# EAGLE design USBHostShield-v13 (EAGLE 5.00)
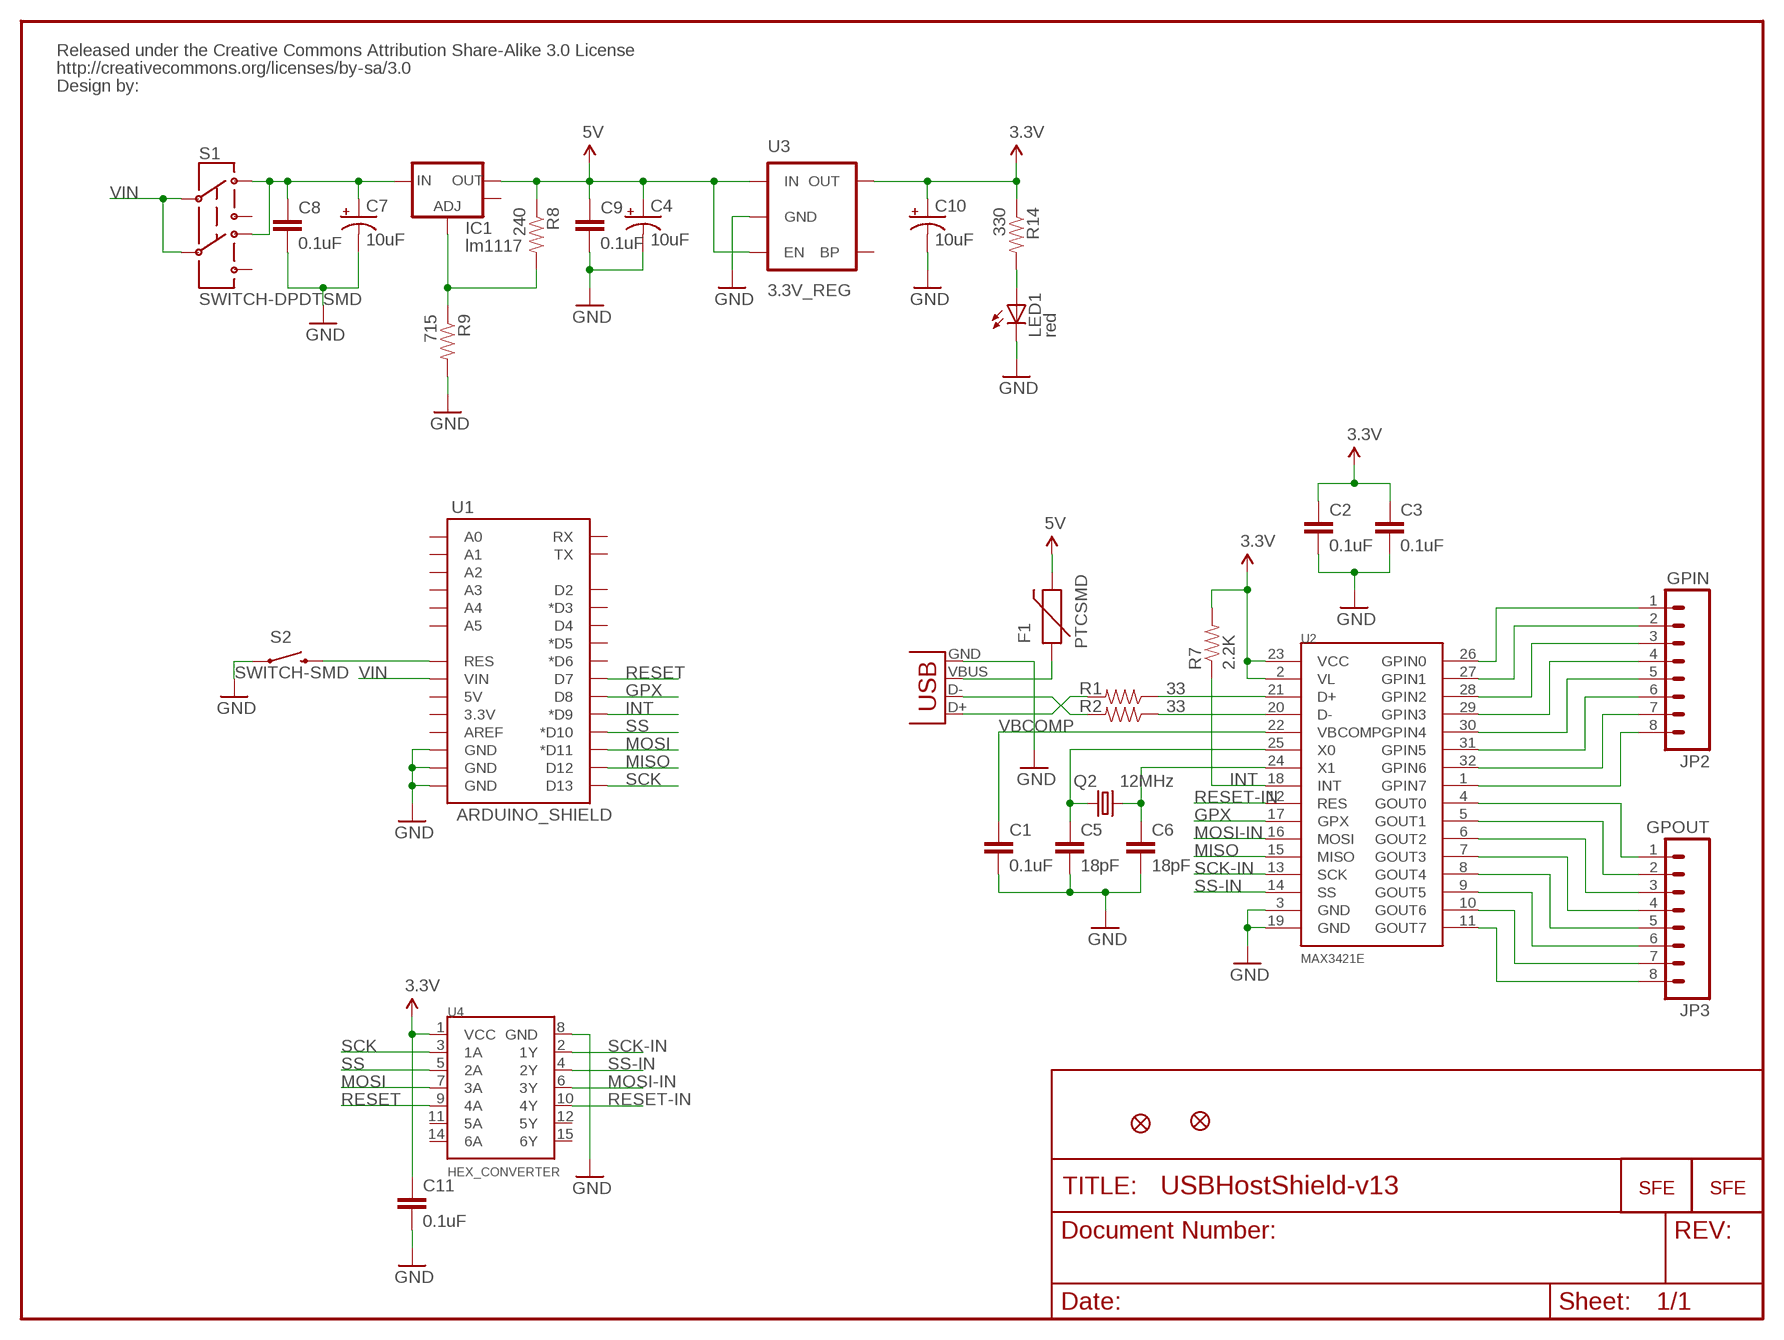
[diagram p0: schematic, sheet 1]

## Parts
C1  0.1uF  CAP0402-CAP  [0402-CAP]
C2  0.1uF  CAP0402-CAP  [0402-CAP]
C3  0.1uF  CAP0402-CAP  [0402-CAP]
C4  10uF  CAP_POL1206  [EIA3216]
C5  18pF  CAP0402-CAP  [0402-CAP]
C6  18pF  CAP0402-CAP  [0402-CAP]
C7  10uF  CAP_POL1206  [EIA3216]
C8  0.1uF  CAP0402-CAP  [0402-CAP]
C9  0.1uF  CAP0402-CAP  [0402-CAP]
C10  10uF  CAP_POL1206  [EIA3216]
C11  0.1uF  CAP0402-CAP  [0402-CAP]
F1  PTCSMD  [PTC-1206]
IC1  lm1117  V_REG_LM1117SOT223  [SOT223]
JP2  GPIN  M08  [1X08]
JP3  GPOUT  M08  [1X08]
JP4  LOGO-SFESK  [SFE-LOGO-FLAME]
JP5  LOGO-SFENEW  [SFE-NEW-WEBLOGO]
JP6  FIDUCIAL1X2  [FIDUCIAL-1X2]
JP7  FIDUCIAL1X2  [FIDUCIAL-1X2]
LED1  red  LED0603  [LED-0603]
Q2  12MHz  CRYSTAL5X3  [CRYSTAL-SMD-5X3]
R1  33  RESISTOR0402-RES  [0402-RES]
R2  33  RESISTOR0402-RES  [0402-RES]
R7  2.2K  RESISTOR0402-RES  [0402-RES]
R8  240  RESISTOR0402-RES  [0402-RES]
R9  715  RESISTOR0402-RES  [0402-RES]
R14  330  RESISTOR0402-RES  [0402-RES]
S1  SWITCH-DPDTSMD  [AYZ0202]
S2  SWITCH-SMD  SWITCH-MOMENTARY-2SMD  [TACTILE_SWITCH_SMD]
U1  ARDUINO_SHIELD  ARDUINO_SHIELDLABEL  [DUEMILANOVE_SHIELD]
U2  MAX3421E  MAX3421ESMD  [TQFP32-5MM]
U3  3.3V_REG  V_REG_LDOSMD  [SOT23-5]
U4  HEX_CONVERTER  [SO016]
U$3  CREATIVE_COMMONS  [CREATIVE_COMMONS]
X2  USB_  [USB-A-S-SILK-FEMALE]

## Nets
3.3V: C2.1 C3.1 C10.A(+) C11.1 R7.2 R14.1 U2.2(VL) U2.23(VCC) U3.5(OUT) U4.1(VCC)
5V: C4.A(+) C9.1 F1.2 IC1.2(OUT) R8.1 U3.1(IN) U3.3(EN)
GND: C1.2 C2.2 C3.2 C4.C(-) C5.2 C6.2 C7.C(-) C8.2 C9.2 C10.C(-) C11.2 LED1.C R9.2 S2.1 U1.GND@0(GND) U1.GND@1(GND) U1.GND@2(GND) U2.3(GND) U2.19(GND) U3.2(GND) U4.8(GND) X2.GND
GPX: U1.D8 U2.17(GPX)
INT: R7.1 U1.D9(*D9) U2.18(INT)
MISO: U1.D12 U2.15(MISO)
MOSI: U1.D11(*D11) U4.7(3A)
MOSI-IN: U2.16(MOSI) U4.6(3Y)
N$1: JP2.8 U2.1(GPIN7)
N$2: R2.1 U2.20(D-)
N$3: R1.1 U2.21(D+)
N$4: JP3.1 U2.4(GOUT0)
N$5: R1.2 X2.D+
N$6: JP3.2 U2.5(GOUT1)
N$7: JP3.3 U2.6(GOUT2)
N$8: R2.2 X2.D-
N$9: C5.1 Q2.1 U2.25(X0)
N$10: C6.1 Q2.3 U2.24(X1)
N$11: IC1.1(ADJ) R8.2 R9.1
N$12: S2.3 U1.RES
N$13: JP3.4 U2.7(GOUT3)
N$14: JP3.5 U2.8(GOUT4)
N$15: JP3.6 U2.9(GOUT5)
N$16: JP3.7 U2.10(GOUT6)
N$17: JP3.8 U2.11(GOUT7)
N$18: JP2.7 U2.32(GPIN6)
N$19: JP2.6 U2.31(GPIN5)
N$20: JP2.5 U2.30(GPIN4)
N$21: JP2.4 U2.29(GPIN3)
N$22: JP2.3 U2.28(GPIN2)
N$23: JP2.2 U2.27(GPIN1)
N$24: JP2.1 U2.26(GPIN0)
N$25: LED1.A R14.2
N$138: F1.1 X2.VBUS
RESET: U1.D7 U4.9(4A)
RESET-IN: U2.12(RES) U4.10(4Y)
SCK: U1.D13 U4.3(1A)
SCK-IN: U2.13(SCK) U4.2(1Y)
SS: U1.D10(*D10) U4.5(2A)
SS-IN: U2.14(SS) U4.4(2Y)
VBCOMP: C1.1 U2.22(VBCOMP)
VBUS: C7.A(+) C8.1 IC1.3(IN) S1.1 S1.4
VIN: S1.2 S1.5 U1.VIN
Unconnected: IC1.4(OUT) S1.3 S1.6 U1.3.3V U1.5V U1.A0 U1.A1 U1.A2 U1.A3 U1.A4 U1.A5 U1.AREF U1.D2 U1.D3(*D3) U1.D4 U1.D5(*D5) U1.D6(*D6) U1.RX U1.TX U3.4(BP) U4.11(5A) U4.12(5Y) U4.14(6A) U4.15(6Y)

## Library data of the parts
C1-C3 C5 C6 C8 C9 C11 = SparkFun:CAP: Capacitor Standard 0603 ceramic capacitor, and 0.1" leaded capacitor.
C4 C7 C10 = SparkFun:CAP_POL: Capacitor Polarized These are standard SMD and PTH capacitors. Normally 10uF, 47uF, and 100uF in electrolytic and tantalum varieties. Always verify the external diameter of the through hole cap, it varies with capacity, voltage, and manufacturer. The EIA devices should be standard.
F1 = SparkFun:PTC: Resettable Fuse PTC Resettable Fuse. Spark Fun Electronics SKU : COM-08357
IC1 = SparkFun:V_REG_LM1117: Voltage Regulator LM1117 Standard adjustable voltage regulator but in SMD form. Spark Fun Electronics SKU : COM-00595
JP2 JP3 = SparkFun:M08: Header 8 Standard 8-pin 0.1" header. Use with straight break away headers (SKU : PRT-00116), right angle break away headers (PRT-00553), swiss pins (PRT-00743), machine pins (PRT-00117), and female headers (PRT-00115).
JP4 JP5 = SparkFun:LOGO-SFE: Spark Fun Electronics PCB Logo This is the standard Spark Fun Electronics PCB logo.
JP6 JP7 = SparkFun:FIDUCIAL: Fiducial Alignment Points Various fiducial points for machine vision alignment.
LED1 = SparkFun:LED: LEDs Standard schematic elements and footprints for 5mm, 3mm, 1206, and 0603 sized LEDs. 5mm - Spark Fun Electronics SKU : COM-00529 (and others)
Q2 = SparkFun:CRYSTAL: Crystals Various standard crystals. Proven footprints. Spark Fun Electronics SKU : COM-00534
R1 R2 R7-R9 R14 = SparkFun:RESISTOR: Resistor Basic schematic elements and footprints for 0603, 1206, and PTH 1/10th watt (small) resistors.
S1 = SparkFun:SWITCH-DPDT: DPDT Version of the COM-00597
S2 = SparkFun:SWITCH-MOMENTARY-2
U1 = SparkFun:ARDUINO_SHIELD
U2 = SparkFun:MAX3421E: USB Peripheral/Host Controller w/ SPI
U3 = SparkFun:V_REG_LDO: Voltage Regulator LDO Standard 150mA LDO voltage regulator in SOT-23 layout. Micrel part MIC5205. BP (by-pass) pin is used to lower output noise with 470pF cap.
U4 = SparkFun:HEX_CONVERTER
U$3 = SparkFun:CREATIVE_COMMONS
X2 = SparkFun:USB: USB Connectors USB-B-PTH is fully proven SKU : PRT-00139 USB-miniB is fully proven SKU : PRT-00587 USB-A-PCB is untested. USB-A-H is throughly reviewed, but untested. Spark Fun Electronics SKU : PRT-00437 USB-B-SMT is throughly reviewed, but untested. Needs silkscreen touching up. USB-A-S has not been used/tested USB-MB-H has not been used/tested

## Board
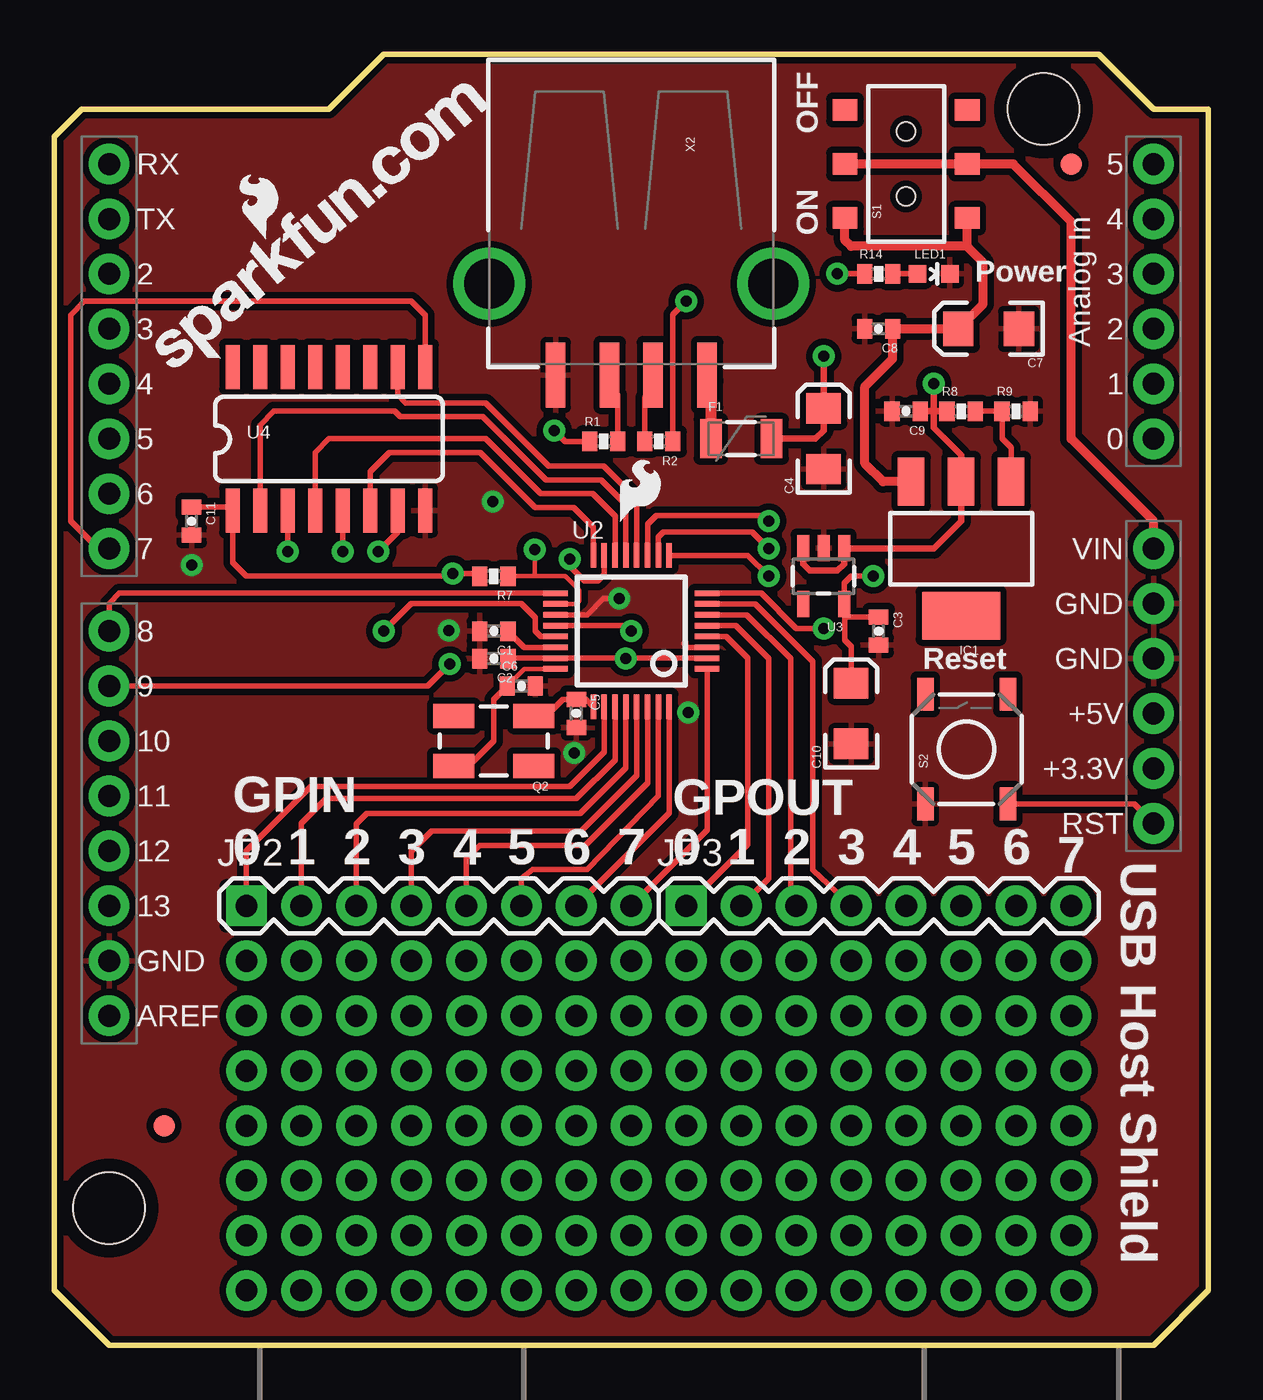
[diagram p1: board, top side]
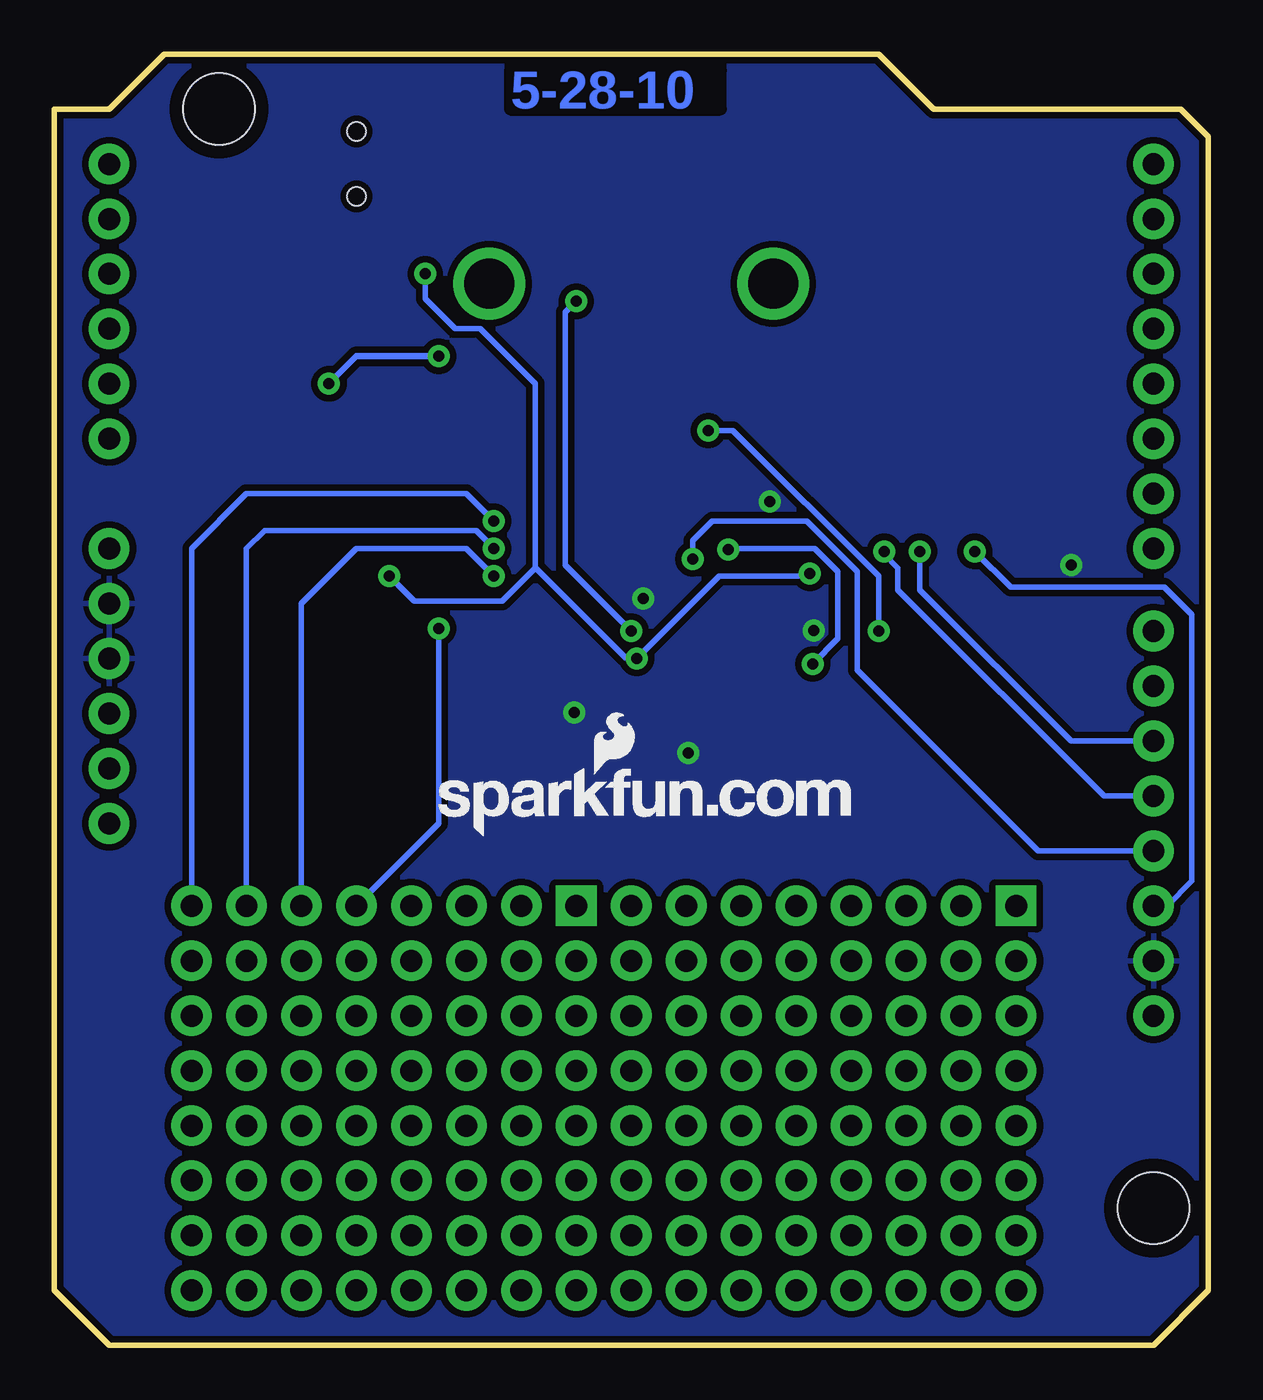
[diagram p2: board, bottom side, seen from below]

Size 53.34 x 59.69 mm. Coordinates in mm from the lower left corner, seen from the top.
Outline: 0,2.54 2.54,0 50.8,0 53.34,2.54 53.34,57.15 50.8,57.15 48.26,59.69 15.24,59.69 12.7,57.15 1.27,57.15 0,55.88 0,2.54
Copper layers (1*16): Top 0.035mm / dielectric 1.5mm / Bottom 0.035mm
Design rules "SparkFun": minimum track width 8mil, minimum drill 20mil, track to track 8mil, track to pad 8mil, pad to pad 8mil, via to via 8mil, smd to smd 8mil, copper to edge 8mil, drill to drill 8mil, minimum pad ring 12mil, minimum via ring 10mil, stop-mask expansion 4mil, vias tented up to drill 20mil, thermal gap 10mil

### Footprints (pad centres in the part's own frame; a part is rotated, then mirrored left to right if it is on the bottom)
0402-CAP = smd 0.7 x 0.9: 1 -0.65,0; 2 0.65,0
EIA3216 = smd 1.4 x 1.6: A 1.4,0; C -1.4,0
PTC-1206 = smd 1 x 1.8: 1 -1.4,0; 2 1.4,0
SOT223 = smd 1.219 x 2.235: 1 -2.311,-3.099; 2 0,-3.099; 3 2.311,-3.099 | smd 3.6 x 2.2: 4 0,3.099
1X08 = drill 1.016 pad 1.88 square: 1 0,0 | drill 1.016 pad 1.88 round: 2 2.54,0; 3 5.08,0; 4 7.62,0; 5 10.16,0; 6 12.7,0; 7 15.24,0; 8 17.78,0
FIDUCIAL-1X2 = smd 1 x 1: 1 0,0
LED-0603 = smd 0.8 x 0.8: A 0,-0.75; C 0,0.75
CRYSTAL-SMD-5X3 = smd 1.9 x 1.1: 1 -1.85,-1.15; 2 1.85,-1.15; 3 1.85,1.15; 4 -1.85,1.15
0402-RES = smd 0.7 x 0.9: 1 -0.65,0; 2 0.65,0
AYZ0202 = smd 1 x 1.15: 1 -2.5,2.825; 2 0,2.825; 3 2.5,2.825; 4 -2.5,-2.825; 5 0,-2.825; 6 2.5,-2.825 | hole 0.85: 1.5,0; -1.5,0
TACTILE_SWITCH_SMD = smd 1.524 x 0.762: 1 -2.54,1.905; 2 2.54,1.905; 3 -2.54,-1.905; 4 2.54,-1.905
DUEMILANOVE_SHIELD = drill 1.016 pad 1.88 round: 3.3V 50.8,26.67; 5V 50.8,29.21; A0 50.8,41.91; A1 50.8,44.45; A2 50.8,46.99; A3 50.8,49.53; A4 50.8,52.07; A5 50.8,54.61; AREF 2.54,15.24; D2 2.54,49.53; D3 2.54,46.99; D4 2.54,44.45; D5 2.54,41.91; D6 2.54,39.37; D7 2.54,36.83; D8 2.54,33.02; D9 2.54,30.48; D10 2.54,27.94; D11 2.54,25.4; D12 2.54,22.86; D13 2.54,20.32; GND@0 50.8,31.75; GND@1 50.8,34.29; GND@2 2.54,17.78; RES 50.8,24.13; RX 2.54,54.61; TX 2.54,52.07; VIN 50.8,36.83 | hole 3.302: 45.72,57.15; 2.54,6.35
TQFP32-5MM = smd 1.143 x 0.254: 1 -3.5,1.75; 2 -3.5,1.25; 3 -3.5,0.75; 4 -3.5,0.25; 5 -3.5,-0.25; 6 -3.5,-0.75; 7 -3.5,-1.25; 8 -3.5,-1.75; 17 3.5,-1.75; 18 3.5,-1.25; 19 3.5,-0.75; 20 3.5,-0.25; 21 3.5,0.25; 22 3.5,0.75; 23 3.5,1.25; 24 3.5,1.75 | smd 0.254 x 1.143: 9 -1.75,-3.5; 10 -1.25,-3.5; 11 -0.75,-3.5; 12 -0.25,-3.5; 13 0.25,-3.5; 14 0.75,-3.5; 15 1.25,-3.5; 16 1.75,-3.5; 25 1.75,3.5; 26 1.25,3.5; 27 0.75,3.5; 28 0.25,3.5; 29 -0.25,3.5; 30 -0.75,3.5; 31 -1.25,3.5; 32 -1.75,3.5
SOT23-5 = smd 0.55 x 1.2: 1 -0.95,-1.3; 2 0,-1.3; 3 0.95,-1.3; 4 0.95,1.3; 5 -0.95,1.3
SO016 = smd 0.66 x 2.032: 1 -4.445,-3.315; 2 -3.175,-3.315; 3 -1.905,-3.315; 4 -0.635,-3.315; 5 0.635,-3.315; 6 1.905,-3.315; 7 3.175,-3.315; 8 4.445,-3.315; 9 4.445,3.315; 10 3.175,3.315; 11 1.905,3.315; 12 0.635,3.315; 13 -0.635,3.315; 14 -1.905,3.315; 15 -3.175,3.315; 16 -4.445,3.315
USB-A-S-SILK-FEMALE = smd 3 x 0.9: D+ 7.212,-1; D- 7.212,1; GND 7.212,-3.5; VBUS 7.212,3.5 | drill 2.311 round: P$5 3,-6.566; P$6 3,6.566

### Placement (x,y rotation side)
C1  20.32,33.02 180 top
C2  20.32,31.75 180 top
C3  38.1,33.02 270 top
C4  35.56,41.91 90 top
C5  24.13,29.21 270 top
C6  21.59,30.48 0 top
C7  43.18,46.99 180 top
C8  38.1,46.99 180 top
C9  39.37,43.18 180 top
C10  36.83,29.21 90 top
C11  6.35,38.1 270 top
F1  31.75,41.91 0 top
IC1  41.91,36.83 180 top
JP1  LOGO-SFENEW  [SFE-NEW-WEBLOGO]  6.1,44.3 40 top
JP2  8.89,20.32 0 top
JP3  29.21,20.32 0 top
JP4  26.16,38.1 0 top
JP5  35.59,23.54 0 bottom
JP6  5.08,10.16 0 top
JP7  46.99,54.61 0 top
LED1  40.64,49.53 270 top
Q2  20.32,27.94 180 top
R1  25.4,41.78 0 top
R2  27.94,41.78 180 top
R7  20.32,35.56 180 top
R8  41.91,43.18 0 top
R9  44.45,43.18 0 top
R14  38.1,49.53 0 top
S1  39.37,54.61 90 top
S2  42.16,27.56 90 top
U1  0,0 0 top
U2  26.67,33.02 180 top
U3  35.56,35.56 180 top
U4  12.7,41.91 0 top
U$3  20.32,-24.13 0 top  (outside the outline)
X2  26.67,52.07 270 top

### Tracks (layer width: path | path; a pad name or v marks a point on that pad's centre or on a via)
3.3V  (via drill 0.51)
  Top 0.254: v36.2,49.53 R14.1 | v37.85,35.56 36.83,35.56 36.51,35.24 U3.5 36.54,34.29 36.54,33.66 | U2.2 26.44,31.77 v26.42,31.75 26.4,31.77 U2.23 20.99,31.77 C2.1 | R7.2 19.54,35.69 v18.41,35.69 18.29,35.56 8.89,35.56 8.26,36.2 U4.1 8.1,38.75 C11.1 | 36.54,33.66 36.54,32.6 36.83,32.31 C10.A | C3.1 36.55,33.67 36.54,33.66
  Bottom 0.254: v18.41,35.69 18.54,35.56 22.61,35.56 v26.42,31.75 26.44,31.77 26.92,31.77 31.11,35.96 | v36.2,49.53 36.2,48.39 34.8,46.99 33.66,46.99 31.11,44.45 31.11,35.96 | 31.11,35.96 31.11,35.94 32.64,34.42 36.7,34.42 v37.85,35.56
5V  (via drill 0.51)
  Top 0.254: U3.1 36.54,36.83 | C4.A
  Top 0.305: 36.54,36.83 40.64,36.83 41.91,38.1 IC1.2 41.91,41.15 40.64,42.42 40.64,43.18 | U3.1 36.51,36.13 36.2,35.81 34.92,35.81 34.61,36.13 U3.3 | v35.56,45.72 C4.A 35.56,42.29 35.18,41.91 F1.2 | 40.64,43.18 v40.64,44.45 | 40.64,43.18 R8.1 | 40.64,43.18 C9.1
  Bottom 0.305: v40.64,44.45 39.37,45.72 v35.56,45.72
GND  (via drill 0.51)
  Top 0.254: 24.12,33.77 24.13,33.78 24.14,33.77 | U2.19 24.14,33.77 | 24.14,33.77 24.63,33.77 25.38,34.52 v26.11,34.52 | U2.3 29.25,32.27 29.08,32.44
  other vias: 29.31,29.26 24.03,27.38 18.24,33.05 6.35,36.07 20.27,39.01
  pour Top (isolate 0.305): 0,0 0,59.69 53.34,59.69 53.34,0
  pour Bottom (isolate 0.305): 0,0 0,59.69 53.34,59.69 53.34,0
GPX
  Top 0.254: U2.17 3.02,34.77 2.54,34.29 U1.D8
INT  (via drill 0.51)
  Top 0.203: 23.15,34.29 U2.18 24.11,34.27 24.26,34.42 24.26,34.92 23.62,35.56 22.15,35.56 | 22.15,35.56 R7.1 | v22.2,36.78 22.2,35.61 22.15,35.56
  Top 0.254: U1.D9 17.27,30.48 v18.29,31.5
  Bottom 0.254: v22.2,36.78 22.15,36.83 18.19,36.83 17.12,35.76 17.12,32.66 v18.29,31.5
MISO  (via drill 0.51)
  Top 0.254: v23.82,36.35 23.82,36.02 24.51,35.33 25.12,35.33 25.42,35.63 U2.15
  Bottom 0.254: U1.D12 7.87,22.86 16.23,31.22 16.23,35.76 18.57,38.1 22.94,38.1 23.82,37.21 v23.82,36.35
MOSI  (via drill 0.51)
  Top 0.254: U4.7 15.88,37.59 v14.99,36.7
  Bottom 0.254: v14.99,36.7 14.99,36.58 14.35,35.94 14.35,34.92 4.83,25.4 U1.D11
MOSI-IN
  Top 0.254: U4.6 14.61,40.39 15.49,41.27 19.68,41.27 22.23,38.73 24,38.73 24.92,37.82 U2.16
N$1
  Top 0.254: U2.1 30.17,23.82 JP2.8
N$2  (via drill 0.51)
  Top 0.254: U2.20 26.29,33.27 v26.67,33.02 | R2.1 28.59,47.64 v29.21,48.26
  Bottom 0.254: v26.67,33.02 29.72,36.07 29.72,47.75 v29.21,48.26
N$3  (via drill 0.51)
  Top 0.254: v15.24,33.02 16.51,34.29 21.59,34.29 22.23,33.66 22.23,33.02 22.48,32.77 U2.21 | R1.1 23.62,41.78 v23.11,42.29
  Bottom 0.254: v15.24,33.02 15.24,35.56 21.97,42.29 v23.11,42.29
N$4
  Top 0.254: U2.4 31.06,32.77 32.05,31.77 32.05,23.16 JP3.1
N$5
  Top 0.254: R1.2 26.05,43.93 25.67,44.31 X2.D+
N$6
  Top 0.254: U2.5 31.5,33.27 33.02,31.75 33.02,21.59 JP3.2
N$7
  Top 0.254: U2.6 32.02,33.77 34.04,31.75 34.04,20.57 JP3.3
N$8
  Top 0.254: R2.2 27.29,43.8 27.67,44.18 X2.D-
N$9
  Top 0.254: U2.25 24.58,29.86 C5.1 23.51,29.86 22.86,29.21 22.29,29.21 Q2.1
N$10
  Top 0.203: U2.24 21.73,31.27 C6.1
  Top 0.254: Q2.3 19.17,26.79 20.32,27.94 20.32,29.86 C6.1 21.03,30.48
N$11
  Top 0.254: R8.2 R9.1 43.8,41.92 44.22,41.5 IC1.1
N$12
  Top 0.254: S2.3 49.91,25.02 U1.RES
N$13
  Top 0.254: U2.7 32.41,34.27 35.05,31.62 35.05,21.97 JP3.4
N$14  (via drill 0.51)
  Top 0.254: U2.8 32.67,34.77 34.29,33.15 v35.56,33.15
  Bottom 0.254: v35.56,33.15 35.56,24.13 JP3.5
N$15  (via drill 0.51)
  Top 0.254: U2.9 32.06,36.52 v33.02,35.56
  Bottom 0.254: v33.02,35.56 34.29,36.83 39.37,36.83 41.91,34.29 JP3.6
N$16  (via drill 0.51)
  Top 0.254: U2.10 27.92,37.37 28.14,37.59 32.26,37.59 v33.02,36.83
  Bottom 0.254: v33.02,36.83 33.02,36.85 33.83,37.67 43.61,37.67 44.45,36.83 JP3.7
N$17  (via drill 0.51)
  Top 0.254: U2.11 27.42,37.96 27.81,38.35 32.77,38.35 v33.02,38.1
  Bottom 0.254: JP3.8 46.99,36.83 44.45,39.37 34.29,39.37 v33.02,38.1
N$18
  Top 0.254: U2.32 28.42,24.61 JP2.7
N$19
  Top 0.254: U2.31 27.92,25.41 24.64,22 22.12,22 21.59,21.59 JP2.6
N$20
  Top 0.254: U2.30 27.42,26 24.54,23.11 19.66,23.11 19.05,22.5 JP2.5
N$21
  Top 0.254: U2.29 26.92,26.34 24.36,23.77 17.45,23.77 16.51,22.84 JP2.4
N$22
  Top 0.254: U2.28 26.42,26.7 24.31,24.59 14.45,24.59 13.97,24.11 JP2.3
N$23
  Top 0.254: U2.27 25.92,27.06 24.13,25.27 12.57,25.27 11.43,24.13 JP2.2
N$24
  Top 0.254: JP2.1 8.89,22.86 11.86,25.83 23.82,25.83 25.42,27.43 U2.26
N$25
  Top 0.254: LED1.A R14.2
N$26  (via drill 1.02 pad 1.88)
  other vias: 8.89,17.78
N$27  (via drill 1.02 pad 1.88)
  other vias: 8.89,15.24
N$28  (via drill 1.02 pad 1.88)
  other vias: 8.89,12.7
N$29  (via drill 1.02 pad 1.88)
  other vias: 8.89,10.16
N$30  (via drill 1.02 pad 1.88)
  other vias: 8.89,7.62
N$31  (via drill 1.02 pad 1.88)
  other vias: 8.89,5.08
N$32  (via drill 1.02 pad 1.88)
  other vias: 8.89,2.54
N$33  (via drill 1.02 pad 1.88)
  other vias: 11.43,17.78
N$34  (via drill 1.02 pad 1.88)
  other vias: 11.43,15.24
N$35  (via drill 1.02 pad 1.88)
  other vias: 11.43,12.7
N$36  (via drill 1.02 pad 1.88)
  other vias: 11.43,10.16
N$37  (via drill 1.02 pad 1.88)
  other vias: 11.43,7.62
N$38  (via drill 1.02 pad 1.88)
  other vias: 11.43,5.08
N$39  (via drill 1.02 pad 1.88)
  other vias: 11.43,2.54
N$40  (via drill 1.02 pad 1.88)
  other vias: 13.97,2.54
N$41  (via drill 1.02 pad 1.88)
  other vias: 16.51,2.54
N$42  (via drill 1.02 pad 1.88)
  other vias: 19.05,2.54
N$43  (via drill 1.02 pad 1.88)
  other vias: 21.59,2.54
N$44  (via drill 1.02 pad 1.88)
  other vias: 24.13,2.54
N$45  (via drill 1.02 pad 1.88)
  other vias: 26.67,2.54
N$46  (via drill 1.02 pad 1.88)
  other vias: 29.21,2.54
N$47  (via drill 1.02 pad 1.88)
  other vias: 31.75,2.54
N$48  (via drill 1.02 pad 1.88)
  other vias: 34.29,2.54
N$49  (via drill 1.02 pad 1.88)
  other vias: 36.83,2.54
N$50  (via drill 1.02 pad 1.88)
  other vias: 39.37,2.54
N$51  (via drill 1.02 pad 1.88)
  other vias: 41.91,2.54
N$52  (via drill 1.02 pad 1.88)
  other vias: 44.45,2.54
N$53  (via drill 1.02 pad 1.88)
  other vias: 46.99,2.54
N$54  (via drill 1.02 pad 1.88)
  other vias: 46.99,17.78
N$55  (via drill 1.02 pad 1.88)
  other vias: 46.99,15.24
N$56  (via drill 1.02 pad 1.88)
  other vias: 46.99,12.7
N$57  (via drill 1.02 pad 1.88)
  other vias: 46.99,10.16
N$58  (via drill 1.02 pad 1.88)
  other vias: 46.99,7.62
N$59  (via drill 1.02 pad 1.88)
  other vias: 46.99,5.08
N$60  (via drill 1.02 pad 1.88)
  other vias: 13.97,17.78
N$61  (via drill 1.02 pad 1.88)
  other vias: 13.97,15.24
N$62  (via drill 1.02 pad 1.88)
  other vias: 13.97,12.7
N$63  (via drill 1.02 pad 1.88)
  other vias: 13.97,10.16
N$64  (via drill 1.02 pad 1.88)
  other vias: 13.97,7.62
N$65  (via drill 1.02 pad 1.88)
  other vias: 13.97,5.08
N$66  (via drill 1.02 pad 1.88)
  other vias: 16.51,5.08
N$67  (via drill 1.02 pad 1.88)
  other vias: 16.51,7.62
N$68  (via drill 1.02 pad 1.88)
  other vias: 16.51,10.16
N$69  (via drill 1.02 pad 1.88)
  other vias: 16.51,12.7
N$70  (via drill 1.02 pad 1.88)
  other vias: 16.51,15.24
N$71  (via drill 1.02 pad 1.88)
  other vias: 16.51,17.78
N$72  (via drill 1.02 pad 1.88)
  other vias: 19.05,17.78
N$73  (via drill 1.02 pad 1.88)
  other vias: 19.05,15.24
N$74  (via drill 1.02 pad 1.88)
  other vias: 19.05,12.7
N$75  (via drill 1.02 pad 1.88)
  other vias: 19.05,10.16
N$76  (via drill 1.02 pad 1.88)
  other vias: 19.05,7.62
N$77  (via drill 1.02 pad 1.88)
  other vias: 19.05,5.08
N$78  (via drill 1.02 pad 1.88)
  other vias: 21.59,5.08
N$79  (via drill 1.02 pad 1.88)
  other vias: 21.59,7.62
N$80  (via drill 1.02 pad 1.88)
  other vias: 21.59,10.16
N$81  (via drill 1.02 pad 1.88)
  other vias: 21.59,12.7
N$82  (via drill 1.02 pad 1.88)
  other vias: 21.59,15.24
N$83  (via drill 1.02 pad 1.88)
  other vias: 21.59,17.78
N$84  (via drill 1.02 pad 1.88)
  other vias: 24.13,17.78
N$85  (via drill 1.02 pad 1.88)
  other vias: 24.13,15.24
N$86  (via drill 1.02 pad 1.88)
  other vias: 24.13,12.7
N$87  (via drill 1.02 pad 1.88)
  other vias: 24.13,10.16
N$88  (via drill 1.02 pad 1.88)
  other vias: 24.13,7.62
N$89  (via drill 1.02 pad 1.88)
  other vias: 24.13,5.08
N$90  (via drill 1.02 pad 1.88)
  other vias: 26.67,5.08
N$91  (via drill 1.02 pad 1.88)
  other vias: 29.21,5.08
N$92  (via drill 1.02 pad 1.88)
  other vias: 31.75,5.08
N$93  (via drill 1.02 pad 1.88)
  other vias: 34.29,5.08
N$94  (via drill 1.02 pad 1.88)
  other vias: 36.83,5.08
N$95  (via drill 1.02 pad 1.88)
  other vias: 39.37,5.08
N$96  (via drill 1.02 pad 1.88)
  other vias: 41.91,5.08
N$97  (via drill 1.02 pad 1.88)
  other vias: 44.45,5.08
N$98  (via drill 1.02 pad 1.88)
  other vias: 44.45,7.62
N$99  (via drill 1.02 pad 1.88)
  other vias: 44.45,10.16
N$100  (via drill 1.02 pad 1.88)
  other vias: 44.45,12.7
N$101  (via drill 1.02 pad 1.88)
  other vias: 44.45,15.24
N$102  (via drill 1.02 pad 1.88)
  other vias: 44.45,17.78
N$103  (via drill 1.02 pad 1.88)
  other vias: 41.91,17.78
N$104  (via drill 1.02 pad 1.88)
  other vias: 39.37,17.78
N$105  (via drill 1.02 pad 1.88)
  other vias: 36.83,17.78
N$106  (via drill 1.02 pad 1.88)
  other vias: 34.29,17.78
N$107  (via drill 1.02 pad 1.88)
  other vias: 31.75,17.78
N$108  (via drill 1.02 pad 1.88)
  other vias: 29.21,17.78
N$109  (via drill 1.02 pad 1.88)
  other vias: 26.67,17.78
N$110  (via drill 1.02 pad 1.88)
  other vias: 26.67,15.24
N$111  (via drill 1.02 pad 1.88)
  other vias: 29.21,15.24
N$112  (via drill 1.02 pad 1.88)
  other vias: 31.75,15.24
N$113  (via drill 1.02 pad 1.88)
  other vias: 34.29,15.24
N$114  (via drill 1.02 pad 1.88)
  other vias: 36.83,15.24
N$115  (via drill 1.02 pad 1.88)
  other vias: 39.37,15.24
N$116  (via drill 1.02 pad 1.88)
  other vias: 41.91,15.24
N$117  (via drill 1.02 pad 1.88)
  other vias: 41.91,12.7
N$118  (via drill 1.02 pad 1.88)
  other vias: 41.91,10.16
N$119  (via drill 1.02 pad 1.88)
  other vias: 41.91,7.62
N$120  (via drill 1.02 pad 1.88)
  other vias: 39.37,7.62
N$121  (via drill 1.02 pad 1.88)
  other vias: 36.83,7.62
N$122  (via drill 1.02 pad 1.88)
  other vias: 34.29,7.62
N$123  (via drill 1.02 pad 1.88)
  other vias: 31.75,7.62
N$124  (via drill 1.02 pad 1.88)
  other vias: 29.21,7.62
N$125  (via drill 1.02 pad 1.88)
  other vias: 26.67,7.62
N$126  (via drill 1.02 pad 1.88)
  other vias: 26.67,10.16
N$127  (via drill 1.02 pad 1.88)
  other vias: 26.67,12.7
N$128  (via drill 1.02 pad 1.88)
  other vias: 29.21,12.7
N$129  (via drill 1.02 pad 1.88)
  other vias: 31.75,12.7
N$130  (via drill 1.02 pad 1.88)
  other vias: 34.29,12.7
N$131  (via drill 1.02 pad 1.88)
  other vias: 36.83,12.7
N$132  (via drill 1.02 pad 1.88)
  other vias: 39.37,12.7
N$133  (via drill 1.02 pad 1.88)
  other vias: 39.37,10.16
N$134  (via drill 1.02 pad 1.88)
  other vias: 36.83,10.16
N$135  (via drill 1.02 pad 1.88)
  other vias: 34.29,10.16
N$136  (via drill 1.02 pad 1.88)
  other vias: 31.75,10.16
N$137  (via drill 1.02 pad 1.88)
  other vias: 29.21,10.16
N$138
  Top 0.254: 30.38,44.58 30.3,44.65 30.3,44.73 | 30.3,44.73 30.3,45.19 | 30.3,44.73 X2.VBUS | F1.1 30.38,41.94
  Top 0.508: 30.38,41.94 30.38,44.58
RESET
  Top 0.254: U4.9 17.14,47.62 16.51,48.26 1.4,48.26 0.76,47.62 0.76,38.1 2.03,36.83 U1.D7
RESET-IN
  Top 0.254: U2.12 26.92,39.12 25.4,40.64 22.86,40.64 19.94,43.56 16.26,43.56 15.88,43.94 U4.10
SCK  (via drill 0.51)
  Top 0.254: v10.79,36.7 U4.3
  Bottom 0.254: U1.D13 1.91,20.32 0.76,21.46 0.76,33.78 2.03,35.05 9.14,35.05 v10.79,36.7
SCK-IN
  Top 0.254: U4.2 9.53,42.55 10.16,43.18 15.75,43.18 16,42.93 19.81,42.93 22.73,40.01 25.27,40.01 26.42,38.86 U2.13
SS  (via drill 0.51)
  Top 0.254: v13.34,36.7 U4.5
  Bottom 0.254: v13.34,36.7 13.34,34.92 6.35,27.94 U1.D10
SS-IN
  Top 0.254: U4.4 12.06,41.27 12.7,41.91 19.94,41.91 22.48,39.37 24.89,39.37 25.78,38.48 25.91,38.35 25.92,38.34 U2.14
VBCOMP
  Top 0.254: U2.22 21.72,32.27 C1.1
VBUS
  Top 0.254: 42.16,50.8 42.2,50.83
  Top 0.406: IC1.3 38.3,39.93 37.47,40.77 37.47,44.32 38.75,45.61 C8.1 C7.A 42.93,48.14 42.93,50.04 42.16,50.8 36.83,50.8 36.55,51.09 S1.1 | 42.2,50.83 S1.4
VIN
  Top 0.406: U1.VIN 50.8,38.1 46.99,41.91 46.99,51.94 44.32,54.61 S1.5 S1.2

### Text on the board
Bottom: 5-28-10
tPlace: OFF | ON | Power | Reset | GPIN | GPOUT | 0 | 1 | 2 | 3 | 4 | 5 | 6 | 7 | 0 | 1 | 2 | 3 | 4 | 5 | 6 | 7 | USB Host Shield